# EAGLE design s3-pilot1 (EAGLE 7.1.0)
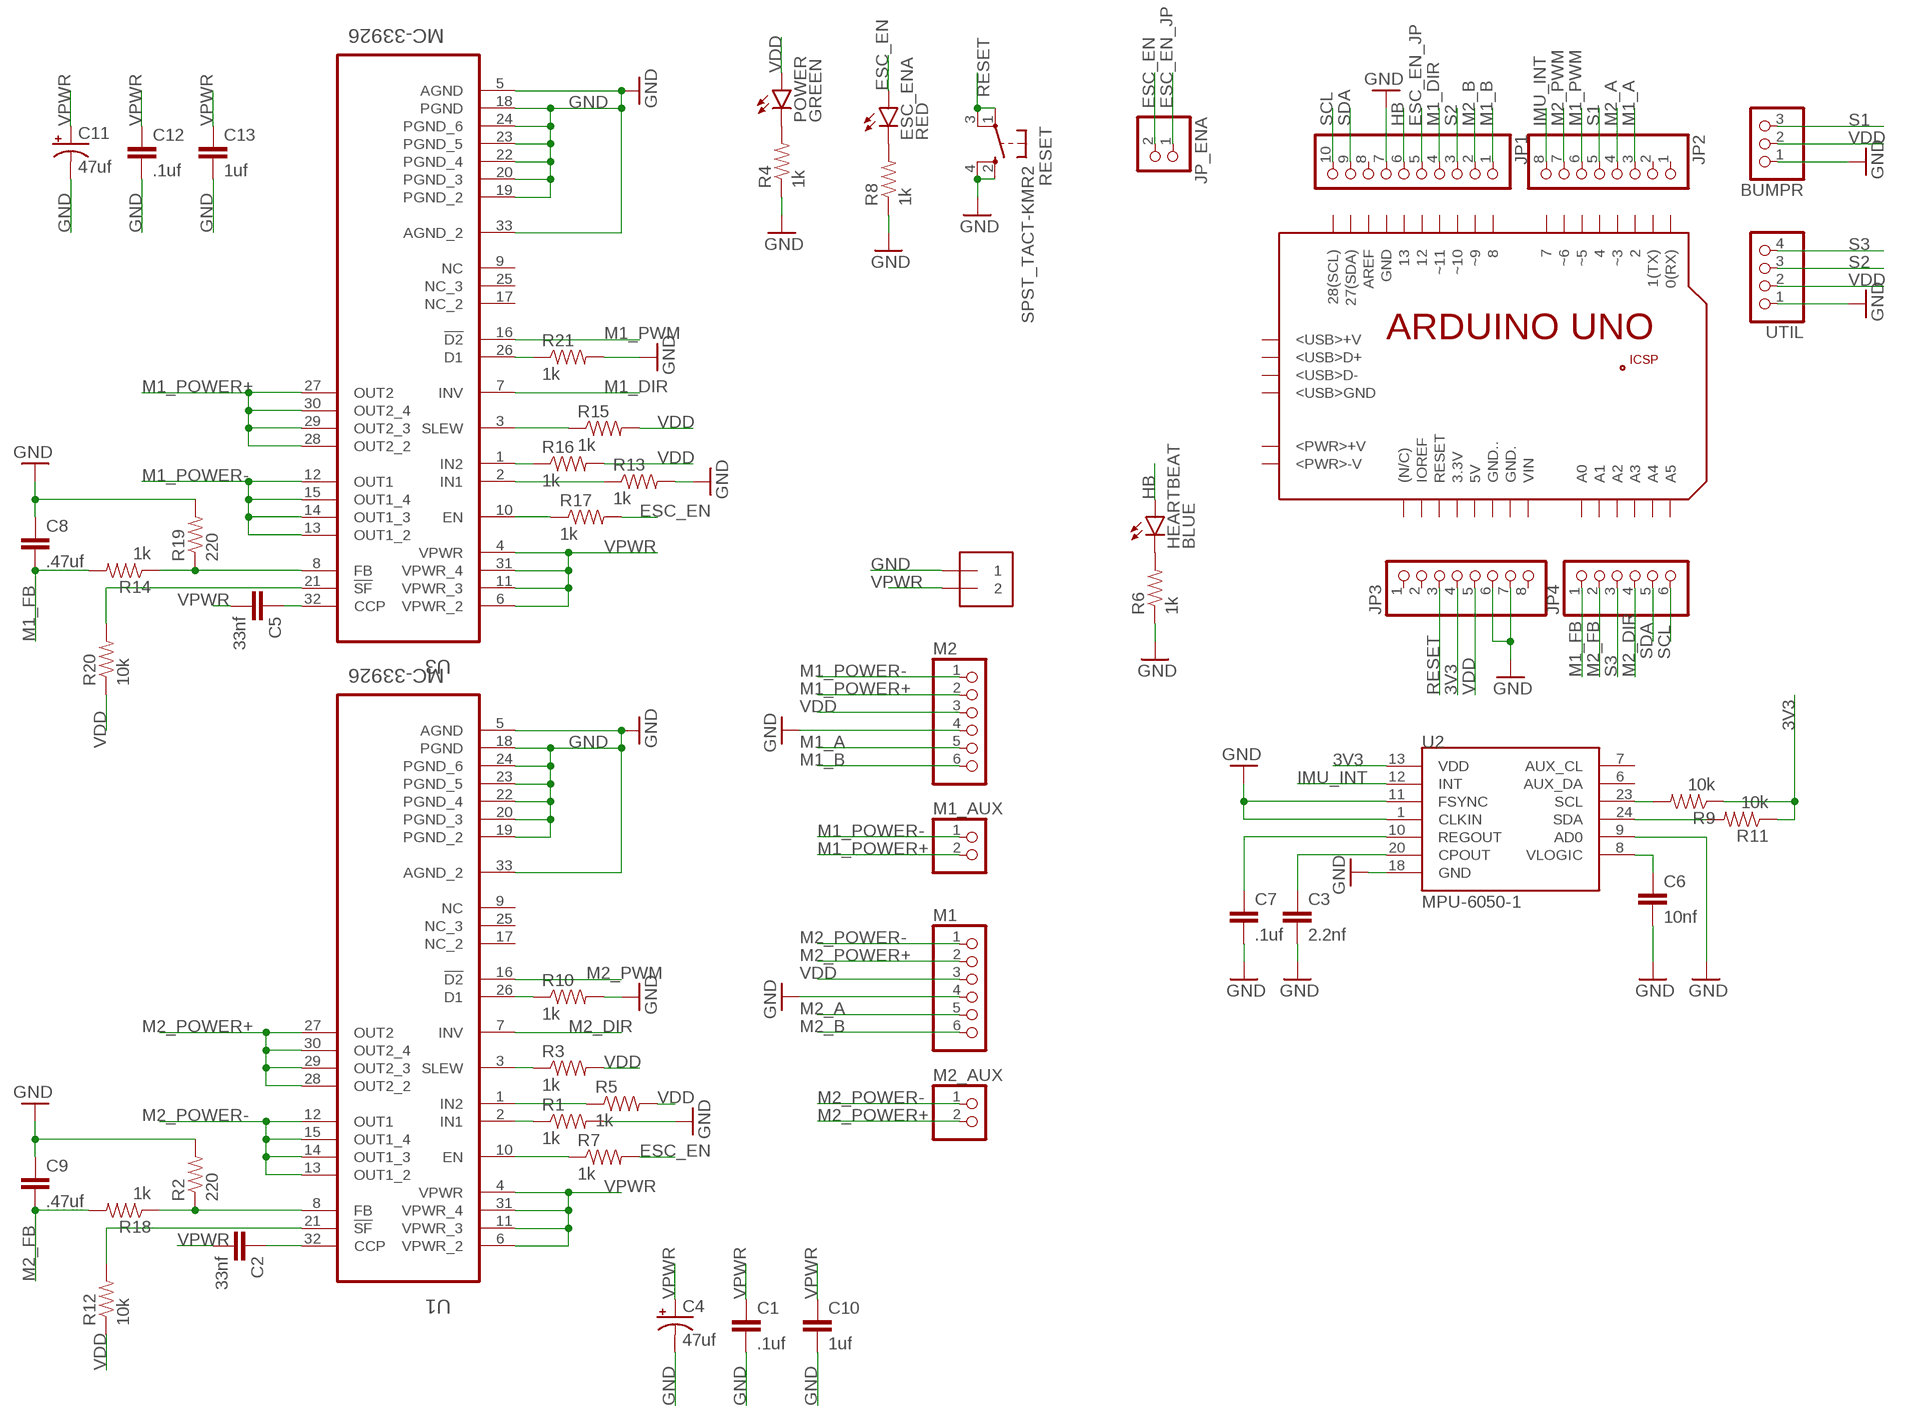
[diagram p0: schematic, sheet 1]

## Parts
BUMPR  PINHD-1X3/90  [1X03/90]
C1  .1uf  CAP0805  [0805]
C2  33nf  CAP0805  [0805]
C3  2.2nf  CAP0805  [0805]
C4  47uf  47UF-50V-20%(ELECT)  [PANASONIC_D]
C5  33nf  CAP0805  [0805]
C6  10nf  CAP0805  [0805]
C7  .1uf  CAP0805  [0805]
C8  .47uf  CAP0805  [0805]
C9  .47uf  CAP0805  [0805]
C10  1uf  CAP0805  [0805]
C11  47uf  47UF-50V-20%(ELECT)  [PANASONIC_D]
C12  .1uf  CAP0805  [0805]
C13  1uf  CAP0805  [0805]
ESC_ENA  RED  LED-RED0603  [LED-0603]
HEARTBEAT  BLUE  LED-BLUE0603  [LED-0603]
JP1  PINHD-1X10  [1X10]
JP2  PINHD-1X8  [1X08]
JP3  PINHD-1X8  [1X08]
JP4  PINHD-1X6  [1X06]
JP_ENA  PINHD-1X2  [1X02]
M1  PINHD-1X6/90  [1X06/90]
M1_AUX  PINHD-1X2/90  [1X02/90]
M2  PINHD-1X6/90  [1X06/90]
M2_AUX  PINHD-1X2/90  [1X02/90]
MOTOR_POWER_IN  1X2-3.5MM  [1X2-3.5MM]
PCB1  ARDUINO_UNO_EXT  (no package)
POWER  GREEN  LED-GREEN0603  [LED-0603]
R1  1k  RESISTOR0805-RES  [0805]
R2  220  RESISTOR0805-RES  [0805]
R3  1k  RESISTOR0805-RES  [0805]
R4  1k  RESISTOR0805-RES  [0805]
R5  1k  RESISTOR0805-RES  [0805]
R6  1k  RESISTOR0805-RES  [0805]
R7  1k  RESISTOR0805-RES  [0805]
R8  1k  RESISTOR0805-RES  [0805]
R9  10k  RESISTOR0805-RES  [0805]
R10  1k  RESISTOR0805-RES  [0805]
R11  10k  RESISTOR0805-RES  [0805]
R12  10k  RESISTOR0805-RES  [0805]
R13  1k  RESISTOR0805-RES  [0805]
R14  1k  RESISTOR0805-RES  [0805]
R15  1k  RESISTOR0805-RES  [0805]
R16  1k  RESISTOR0805-RES  [0805]
R17  1k  RESISTOR0805-RES  [0805]
R18  1k  RESISTOR0805-RES  [0805]
R19  220  RESISTOR0805-RES  [0805]
R20  10k  RESISTOR0805-RES  [0805]
R21  1k  RESISTOR0805-RES  [0805]
RESET  SPST_TACT-KMR2  [KMR2]
U1  MC-33926  FREESCALE-MC33926PNB  [QFN80P800X800X220-33N]
U2  MPU-6050-1  [QFN-24-4MM2]
U3  MC-33926  FREESCALE-MC33926PNB  [QFN80P800X800X220-33N]
UTIL  PINHD-1X4/90  [1X04/90]

## Nets
3V3 [Supply]: JP3.4 R9.1 R11.1 U2.13(VDD)
ESC_EN: ESC_ENA.A JP_ENA.2 R7.2 R17.2
ESC_EN_JP: JP1.5 JP_ENA.1
GND [Supply]: BUMPR.1 C1.2 C3.2 C4.- C6.2 C7.2 C8.1 C9.1 C10.2 C11.- C12.2 C13.2 JP1.7 JP3.6 JP3.7 M1.4 M2.4 MOTOR_POWER_IN.1 R1.2 R2.2 R4.1 R6.1 R8.1 R10.2 R13.2 R19.2 R21.2 RESET.2(S) RESET.4(S1) U1.5(AGND) U1.18(PGND) U1.19(PGND_2) U1.20(PGND_3) U1.22(PGND_4) U1.23(PGND_5) U1.24(PGND_6) U1.33(AGND_2) U2.1(CLKIN) U2.9(AD0) U2.11(FSYNC) U2.18(GND) U3.5(AGND) U3.18(PGND) U3.19(PGND_2) U3.20(PGND_3) U3.22(PGND_4) U3.23(PGND_5) U3.24(PGND_6) U3.33(AGND_2) UTIL.1
HB: HEARTBEAT.A JP1.6
IMU_INT: JP2.8 U2.12(INT)
M1_A: JP2.3 M2.5
M1_B: JP1.1 M2.6
M1_DIR: JP1.4 U3.7(INV)
M1_FB: C8.2 JP4.1 R14.2
M1_POWER+ [MotorSupply]: M1_AUX.2 M2.2 U3.27(OUT2) U3.28(OUT2_2) U3.29(OUT2_3) U3.30(OUT2_4)
M1_POWER- [MotorSupply]: M1_AUX.1 M2.1 U3.12(OUT1) U3.13(OUT1_2) U3.14(OUT1_3) U3.15(OUT1_4)
M1_PWM: JP2.6 U3.16(!D2)
M2_A: JP2.4 M1.5
M2_B: JP1.2 M1.6
M2_DIR: JP4.4 U1.7(INV)
M2_FB: C9.2 JP4.2 R18.2
M2_POWER+ [MotorSupply]: M1.2 M2_AUX.2 U1.27(OUT2) U1.28(OUT2_2) U1.29(OUT2_3) U1.30(OUT2_4)
M2_POWER- [MotorSupply]: M1.1 M2_AUX.1 U1.12(OUT1) U1.13(OUT1_2) U1.14(OUT1_3) U1.15(OUT1_4)
M2_PWM: JP2.7 U1.16(!D2)
N$1: R17.1 U3.10(EN)
N$2: R10.1 U1.26(D1)
N$3: R3.1 U1.3(SLEW)
N$4: R15.1 U3.3(SLEW)
N$5: C5.1 U3.32(CCP)
N$6: C2.1 U1.32(CCP)
N$7: R7.1 U1.10(EN)
N$8: R5.1 U1.1(IN2)
N$9: R1.1 U1.2(IN1)
N$10: R16.1 U3.1(IN2)
N$11: R21.1 U3.26(D1)
N$12: R13.1 U3.2(IN1)
N$15: R12.2 U1.21(!SF)
N$16: R20.2 U3.21(!SF)
N$17: C3.1 U2.20(CPOUT)
N$18: C7.1 U2.10(REGOUT)
N$19: C6.1 U2.8(VLOGIC)
N$20: R2.1 R18.1 U1.8(FB)
N$21: POWER.C R4.2
N$22: R14.1 R19.1 U3.8(FB)
N$23: ESC_ENA.C R8.2
N$24: HEARTBEAT.C R6.2
RESET: JP3.3 RESET.1(P) RESET.3(P1)
S1: BUMPR.3 JP2.5
S2: JP1.3 UTIL.3
S3: JP4.3 UTIL.4
SCL: JP1.10 JP4.6 R9.2 U2.23(SCL)
SDA: JP1.9 JP4.5 R11.2 U2.24(SDA)
VDD [Supply]: BUMPR.2 JP3.5 M1.3 M2.3 POWER.A R3.2 R5.2 R12.1 R15.2 R16.2 R20.1 UTIL.2
VPWR [MotorSupply]: C1.1 C2.2 C4.+ C5.2 C10.1 C11.+ C12.1 C13.1 MOTOR_POWER_IN.2 U1.4(VPWR) U1.6(VPWR_2) U1.11(VPWR_3) U1.31(VPWR_4) U3.4(VPWR) U3.6(VPWR_2) U3.11(VPWR_3) U3.31(VPWR_4)
Unconnected: JP1.8 JP2.1 JP2.2 JP3.1 JP3.2 JP3.8 PCB1.0(RX) PCB1.1(TX) PCB1.2 PCB1.3.3V PCB1.4 PCB1.5V PCB1.7 PCB1.8 PCB1.12 PCB1.13 PCB1.27(SDA) PCB1.28(SCL) PCB1.(N/C) PCB1.+5V PCB1.<PWR>+V PCB1.<PWR>-V PCB1.<USB>+V PCB1.<USB>D+ PCB1.<USB>D- PCB1.<USB>GND PCB1.A0 PCB1.A1 PCB1.A2 PCB1.A3 PCB1.A4 PCB1.A5 PCB1.AREF PCB1.GND PCB1.GND. PCB1.GND.. PCB1.GND_ PCB1.IOREF PCB1.MISO PCB1.MOSI PCB1.RESET PCB1.RESET. PCB1.SCK PCB1.VIN PCB1.~3 PCB1.~5 PCB1.~6 PCB1.~9 PCB1.~10 PCB1.~11 U1.9(NC) U1.17(NC_2) U1.25(NC_3) U2.6(AUX_DA) U2.7(AUX_CL) U3.9(NC) U3.17(NC_2) U3.25(NC_3)

## Library data of the parts
BUMPR = pinhead:PINHD-1X3: PIN HEADER
C1 C2 C5 C8-C10 C12 C13 = Triple_Axis_Accelerometer-Gyro_Breakout_-_MPU-6050_v12:CAP: Capacitor Standard 0603 ceramic capacitor, and 0.1" leaded capacitor.
C3 C6 C7 = SparkFun-Passives:CAP: Capacitor Standard 0603 ceramic capacitor, and 0.1" leaded capacitor.
C4 C11 = SparkFun-Capacitors:47UF-50V-20%(ELECT): CAP-10547; PROD_ID: CAP-10547
ESC_ENA = SparkFun-LED:LED-RED: Assorted Red LEDs LilyPad 1206- DIO-09912 1206- DIO-00809 0603- DIO-00819; PROD_ID: DIO-00819
HEARTBEAT = SparkFun-LED:LED-BLUE: Blue LEDs for production use Various blue LEDs stocked by SparkFun production 0603 - DIO-08575 Rebel - DIO-09553 1206 - DIO-09911; PROD_ID: DIO-08575
JP1 = pinhead:PINHD-1X10: PIN HEADER
JP2 JP3 = pinhead:PINHD-1X8: PIN HEADER
JP4 M1 M2 = pinhead:PINHD-1X6: PIN HEADER
JP_ENA M1_AUX M2_AUX = pinhead:PINHD-1X2: PIN HEADER
MOTOR_POWER_IN = adafruit:1X2: 3.5mm Terminal block http://www.ladyada.net/library/pcb/eaglelibrary.html
PCB1 = E14_Arduino_published:ARDUINO_UNO_EXT: Device for representing an Arduino Uno board in an EAGLE design without the PCB footprint. Created by Dave Young for Element14. More EAGLE documentation at: http://www.element14.com/community/community/knode/cadsoft_eagle
POWER = SparkFun-LED:LED-GREEN: Various green LEDs Green LEDs used in SFE Production 0603- DIO-00821 LARGE- DIO-00862 LILYPAD- DIO-09910; PROD_ID: DIO-00821
R1-R21 = Triple_Axis_Accelerometer-Gyro_Breakout_-_MPU-6050_v12:RESISTOR: Resistor Basic schematic elements and footprints for 0603, 1206, and PTH resistors.
RESET = adafruit:SPST_TACT: SMT 6mm switch, EVQQ2 series http://www.ladyada.net/library/eagle
U1 U3 = Freescale-MC33926PNB:FREESCALE-MC33926PNB: AUTOMOTIVE THROTTLE H-BRIDGE ACTUATOR/ MOTOR EXCITER,QFN-32; MPN: MC33926PNB; OC_FARNELL: 2102575; OC_NEWARK: 40P5023; PACKAGE: QFN-32; SUPPLIER: Freescale
U2 = Triple_Axis_Accelerometer-Gyro_Breakout_-_MPU-6050_v12:MPU-6050
UTIL = pinhead:PINHD-1X4: PIN HEADER

## Net classes
0 Default: width 0.254 mm
1 Supply: width 0.508 mm
2 MotorSupply: width 1.016 mm

## Board
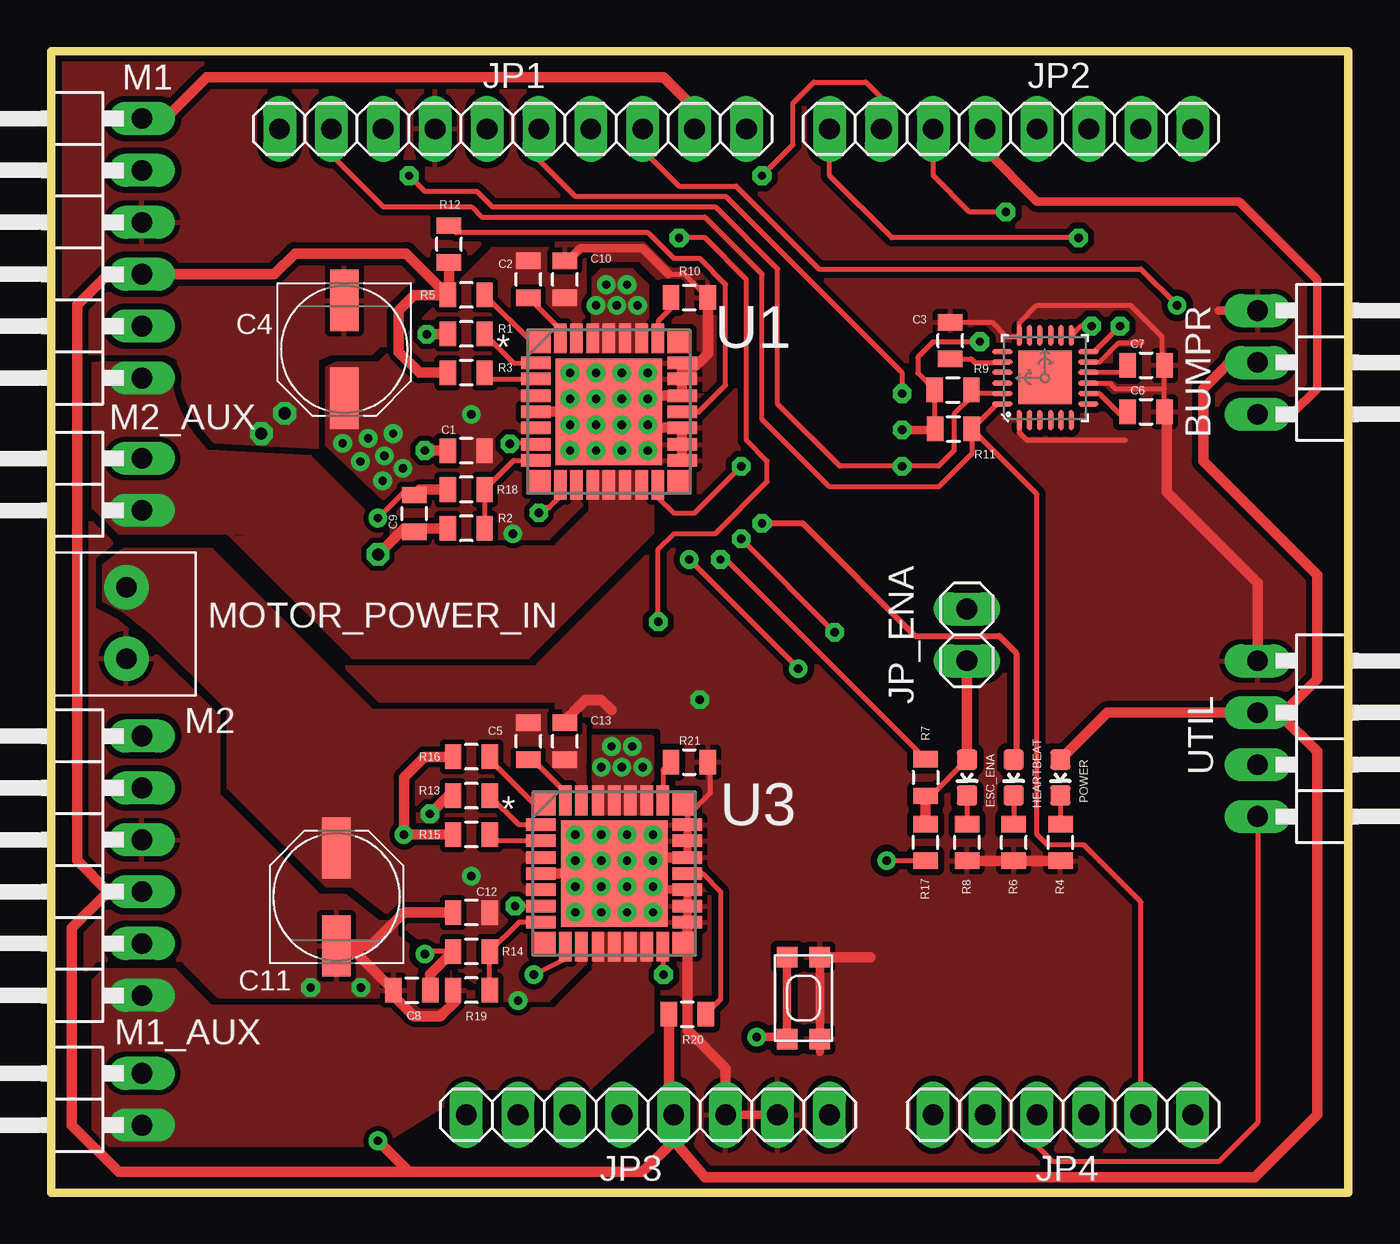
[diagram p1: board, top side]
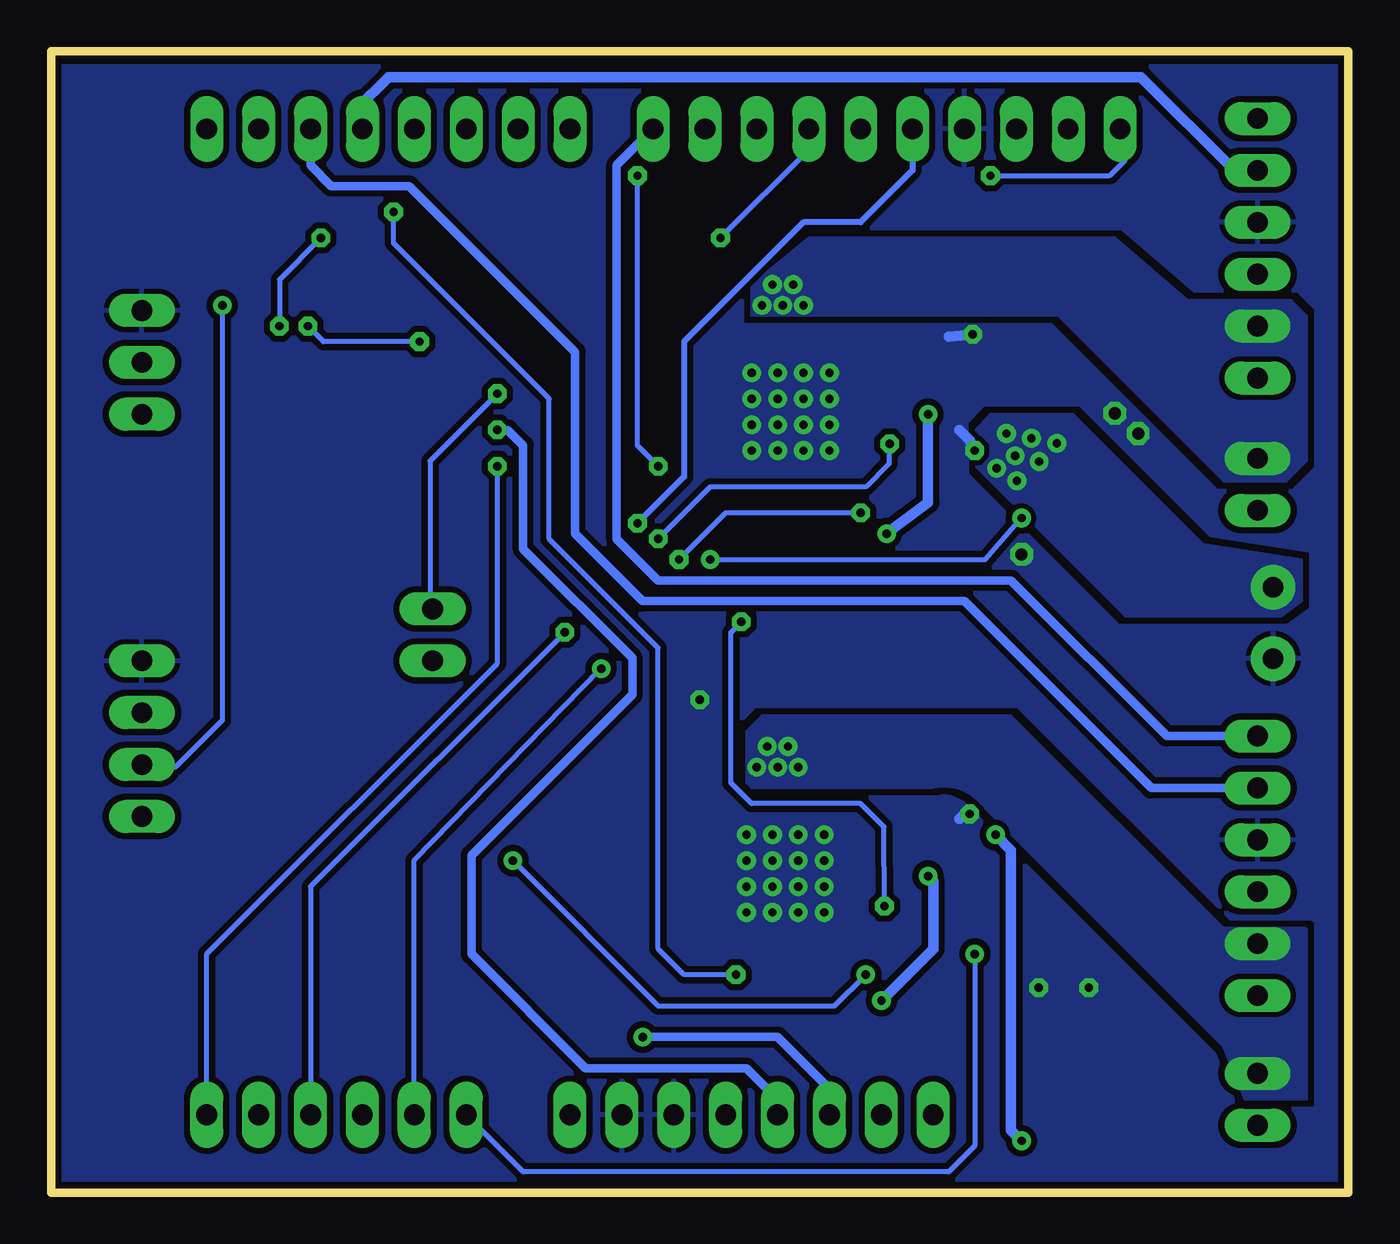
[diagram p2: board, bottom side, seen from below]

Size 63.5 x 55.88 mm. Coordinates in mm from the lower left corner, seen from the top.
Outline: 0,0 63.5,0 63.5,55.88 0,55.88 0,0
Copper layers (1*16): Top 0.035mm / dielectric 1.5mm / Bottom 0.035mm
Design rules "SparkFun *": minimum track width 8mil, minimum drill 16mil, track to track 8mil, track to pad 8mil, pad to pad 8mil, via to via 8mil, smd to smd 8mil, copper to edge 10mil, drill to drill 8mil, minimum pad ring 12mil, minimum via ring 10mil, stop-mask expansion 4mil, vias tented up to drill 25mil, thermal gap 10mil

### Footprints (pad centres in the part's own frame; a part is rotated, then mirrored left to right if it is on the bottom)
1X03/90 = drill 1.016 long: 1 -2.54,-3.81; 2 0,-3.81; 3 2.54,-3.81
0805 = smd 0.8 x 1.2: 1 -0.9,0; 2 0.9,0
PANASONIC_D = smd 3 x 1.4: + 2.4,0; - -2.4,0
LED-0603 = smd 1 x 1: A 0,-0.877; C 0,0.877
1X10 = drill 1.016 long: 1 -11.43,0; 2 -8.89,0; 3 -6.35,0; 4 -3.81,0; 5 -1.27,0; 6 1.27,0; 7 3.81,0; 8 6.35,0; 9 8.89,0; 10 11.43,0
1X08 = drill 1.016 long: 1 -8.89,0; 2 -6.35,0; 3 -3.81,0; 4 -1.27,0; 5 1.27,0; 6 3.81,0; 7 6.35,0; 8 8.89,0
1X06 = drill 1.016 long: 1 -6.35,0; 2 -3.81,0; 3 -1.27,0; 4 1.27,0; 5 3.81,0; 6 6.35,0
1X02 = drill 1.016 long: 1 -1.27,0; 2 1.27,0
1X06/90 = drill 1.016 long: 1 -6.35,-3.81; 2 -3.81,-3.81; 3 -1.27,-3.81; 4 1.27,-3.81; 5 3.81,-3.81; 6 6.35,-3.81
1X02/90 = drill 1.016 long: 1 -1.27,-3.81; 2 1.27,-3.81
1X2-3.5MM = drill 1 pad 2.184: 1 1.8,0; 2 -1.7,0
KMR2 = smd 1 x 1: 1 2,0.8; 2 2,-0.8; 3 -2,0.8; 4 -2,-0.8
QFN80P800X800X220-33N = smd 1.143 x 1.143: 1 -3.429,3.429; 9 -3.429,-3.429; 17 3.429,-3.429; 25 3.429,3.429 | smd 1.448 x 0.61: 2 -3.581,2.388; 3 -3.581,1.6; 4 -3.581,0.787; 5 -3.581,0; 6 -3.581,-0.787; 7 -3.581,-1.6; 8 -3.581,-2.388; 18 3.581,-2.388; 19 3.581,-1.6; 20 3.581,-0.787; 21 3.581,0; 22 3.581,0.787; 23 3.581,1.6; 24 3.581,2.388 | smd 0.61 x 1.448: 10 -2.388,-3.581; 11 -1.6,-3.581; 12 -0.787,-3.581; 13 0,-3.581; 14 0.787,-3.581; 15 1.6,-3.581; 16 2.388,-3.581; 26 2.388,3.581; 27 1.6,3.581; 28 0.787,3.581; 29 0,3.581; 30 -0.787,3.581; 31 -1.6,3.581; 32 -2.388,3.581 | smd 5.207 x 5.207: 33 0,0
QFN-24-4MM2 = smd 1.016 x 0.254: 1 -2.066,1.257; 2 -2.066,0.75; 3 -2.066,0.247; 4 -2.066,-0.287; 5 -2.066,-0.792; 6 -2.066,-1.297; 13 2.086,-1.297; 14 2.086,-0.792; 15 2.086,-0.287; 16 2.086,0.247; 17 2.086,0.75; 18 2.086,1.257 | smd 0.254 x 1.016: 7 -1.267,-2.122; 8 -0.762,-2.122; 9 -0.258,-2.122; 10 0.278,-2.122; 11 0.78,-2.122; 12 1.287,-2.122; 19 1.287,2.082; 20 0.78,2.082; 21 0.278,2.082; 22 -0.258,2.082; 23 -0.762,2.082; 24 -1.267,2.082 | smd 2.616 x 2.616: P$1 0.02,-0.01
1X04/90 = drill 1.016 long: 1 -3.81,-3.81; 2 -1.27,-3.81; 3 1.27,-3.81; 4 3.81,-3.81

### Placement (x,y rotation side)
BUMPR  62.87,40.64 270 top
C1  20.32,36.32 180 top
C2  23.37,44.7 90 top
C3  44.01,41.71 90 top
C4  14.35,41.27 270 top
C5  23.37,22.1 90 top
C6  53.59,38.23 0 top
C7  53.59,40.51 0 top
C8  17.66,9.91 0 top
C9  17.78,33.25 90 top
C10  25.15,44.7 90 top
C11  13.97,14.48 90 top
C12  20.57,13.72 180 top
C13  25.15,22.1 90 top
ESC_ENA  44.83,20.32 180 top
HEARTBEAT  47.12,20.32 180 top
JP1  22.61,52.07 180 top
JP2  46.99,52.07 180 top
JP3  29.21,3.81 0 top
JP4  49.53,3.81 0 top
JP_ENA  44.83,27.3 270 top
M1  0.63,46.23 90 top
M1_AUX  0.63,4.57 90 top
M2  0.63,16 90 top
M2_AUX  0.63,34.67 90 top
MOTOR_POWER_IN  3.68,27.94 270 top
POWER  49.4,20.32 180 top
R1  20.32,42.04 180 top
R2  20.32,32.51 180 top
R3  20.32,40.13 180 top
R4  49.4,17.14 90 top
R5  20.32,43.94 180 top
R6  47.12,17.14 90 top
R7  42.8,20.32 270 top
R8  44.83,17.14 90 top
R9  44.15,39.29 0 top
R10  31.24,43.81 0 top
R11  44.17,37.39 0 top
R12  19.48,46.43 90 top
R13  20.57,19.43 180 top
R14  20.57,11.81 180 top
R15  20.57,17.53 180 top
R16  20.57,21.34 180 top
R17  42.8,17.14 90 top
R18  20.32,34.42 180 top
R19  20.57,9.91 180 top
R20  31.14,8.74 0 top
R21  31.24,21.08 0 top
RESET  36.83,9.52 90 top
U1  27.3,38.23 0 top
U2  48.64,39.88 90 top
U3  27.56,15.62 0 top
UTIL  62.87,22.23 270 top

### Tracks (layer width: path | path; a pad name or v marks a point on that pad's centre or on a via)
3V3  (via drill 0.41)
  Top 0.254: R11.1 43.27,39.27 R9.1 42.42,40.12 42.42,40.89 43.18,41.66 v45.47,41.66 | v50.93,42.42 50.39,42.42 U2.13
  Top 0.406: v41.66,37.34 43.22,37.34 R11.1
  Bottom 0.254: v45.47,41.66 50.16,41.66 v50.93,42.42
  Bottom 0.406: JP3.4 27.94,4.57 29.46,6.1 37.34,6.1 42.93,11.68 42.93,16.51 35.05,24.38 35.05,26.16 40.39,31.5 40.39,36.58 41.15,37.34 v41.66,37.34
ESC_EN
  Top 0.254: R7.2 43.05,19.42 ESC_ENA.A
  Top 0.508: R17.2 R7.2 | JP_ENA.2 ESC_ENA.A
ESC_EN_JP  (via drill 0.41)
  Top 0.254: JP1.5 23.88,50.55 25.65,48.77 33.02,48.77 41.66,40.13 v41.66,39.12
  Bottom 0.254: v41.66,39.12 44.96,35.81 44.96,28.7 JP_ENA.1
GND  (via drill 0.41, 0.6)
  Top 0.254: C6.2 54.49,39.37 | 54.49,39.37 C7.2 54.36,40.65 54.36,41.91 52.83,43.43 48.26,43.43 47.38,42.56 U2.18 47.33,41.91 46.74,41.91 46.04,42.61 C3.2 | U2.11 51.33,40.66 52.27,41.6 53.4,41.6 | U2.1 47.38,37.2 47.75,36.83 52.59,36.83 | R21.2 32.26,20.97 32.26,19.56 31.14,18.44 U3.24 | C10.2 25.28,45.6 | 30.23,44.96 31,44.96 R10.2 | U2.9 51.82,39.62 52.07,39.37 54.49,39.37
  Top 0.406: U3.33 27.56,15.24 28.7,15.24 28.7,14.83 U3.20 U3.19 U3.18 | U3.24 U3.23 U3.22 | RESET.2 RESET.4 37.63,6.9 | 35.56,4.83 JP3.7 JP3.6 | BUMPR.1 57.17,43.18 | 25.28,45.6 25.91,46.23 28.96,46.23 30.23,44.96
  Top 0.508: U3.5 U3.33 28.35,16.41 U3.22 | R19.2 19.77,9.8 arc-45 19.81,9.71 19.81,9.4 19.09,8.67 arc-45 19,8.64 17.78,8.64 16.8,9.62 arc-45 16.76,9.71 C8.1 15.15,11.52 arc-45 15.11,11.61 C11.- 15.63,12.08 17.27,13.72 C12.2 | U3.18 31.14,7.98 33.02,6.1 JP3.6 | C9.1 17.94,32.51 R2.2 17.27,32.51 v16,31.24 | 27.84,37.49 27.89,37.44 U1.20 U1.19 U1.18 | 27.84,37.49 27.3,38.02 U1.33 | U1.5 U1.33 | U1.33 27.3,38.89 27.43,39.01 U1.22 U1.23 | U1.23 U1.24 | R10.2 32.14,41.08 U1.23 | UTIL.1 59.05,29.84 54.61,34.29 54.61,38.62 C6.2 | R8.1 R4.1 R6.1 | RESET.2 40.11,11.52 | C1.2 v18.29,36.32 | R1.2 18.67,42.04 v18.39,42.01 | C13.2 25.15,23.11 26.16,24.13 26.92,24.13 27.43,23.62 | R13.2 19.43,19.43 v18.54,18.54 | v27.94,37.59 27.84,37.49
  Bottom 0.508: v18.29,36.32 18.54,36.83 19.05,37.34 | v16,31.24 15.75,30.99 | v18.39,42.01 19.56,41.91 | v18.54,18.54 18.8,18.54 19.05,18.29
  other vias: 25.4,36.32 25.4,40.13 26.67,37.59 26.67,38.86 26.67,40.13 26.67,36.32 27.94,38.86 27.94,36.32 27.94,40.13 25.4,38.86 25.4,37.59 29.21,40.13 29.21,38.86 29.21,37.59 29.21,36.32 25.65,17.53 25.65,16.26 26.92,17.53 26.92,16.26 25.65,14.99 25.65,13.72 26.92,13.72 29.46,17.53 28.19,16.26 28.19,17.53 29.46,16.26 29.46,14.99 29.46,13.72 28.19,13.72 28.19,14.99 26.92,14.99 11.43,38.15 10.29,37.16 12.7,10.03 15.16,10.03 31.75,24.13
  pour Top (isolate 0.305, rank 4): 0.51,55.37 62.99,55.37 62.99,0.25 0.51,0.25
  pour Bottom (isolate 0.305, rank 4): 0.51,55.12 62.99,55.12 62.99,0.51 0.51,0.51
HB  (via drill 0.41)
  Top 0.305: v34.8,32.77 36.78,32.77 42.29,27.25 46.41,27.25 47.24,26.42 47.24,21.32 HEARTBEAT.A
  Bottom 0.305: JP1.6 21.34,50.04 23.88,47.5 26.67,47.5 32.51,41.66 32.51,35.05 v34.8,32.77
IMU_INT  (via drill 0.41)
  Top 0.254: U2.12 51.07,41.16 v52.32,42.42 | v50.29,46.74 41.15,46.74 38.1,49.78 JP2.8
  Bottom 0.254: v52.32,42.42 52.32,44.7 v50.29,46.74
M1_A
  Bottom 0.406: M2.5 9.65,19.81 18.8,28.96 34.54,28.96 37.85,32.26 37.85,41.15 45.97,49.28 49.78,49.28 50.8,50.29 JP2.3
M1_B
  Bottom 0.406: M2.6 8.89,22.35 16.51,29.97 33.78,29.97 35.81,32 35.81,50.29 JP1.1
M1_DIR  (via drill 0.41)
  Top 0.254: U3.7 v22.71,14.02 | v29.72,27.94 29.72,31.5 30.48,32.26 32.51,32.26 35.05,34.8 35.05,35.81 34.04,36.83 34.04,44.7 32,46.74 v30.73,46.74
  Bottom 0.254: v22.71,14.02 22.73,17.91 23.88,19.05 29.21,19.05 30.23,20.07 30.23,27.43 v29.72,27.94 | v30.73,46.74 26.42,51.05 JP1.4
M1_FB  (via drill 0.41)
  Top 0.254: R14.2 18.41,11.81 v18.29,11.68
  Top 0.508: C8.2 18.56,10.64 arc-45 18.6,10.73 R14.2
  Bottom 0.254: v18.29,11.68 18.29,2.29 19.56,1.02 40.39,1.02 JP4.1
M1_POWER+  (via drill 0.41)
  other vias: 26.92,20.83 27.94,20.83 28.96,20.83 27.43,21.84 28.45,21.84
  pour Top (isolate 0.254, rank 2, no thermals): 26.42,18.54 26.42,22.1 26.42,22.23 arc-90 26.54,22.35 29.34,22.35 arc-90 29.46,22.23 29.46,18.54
  pour Bottom (isolate 0.254, no thermals): 2.03,4.57 2.03,12.83 arc-90 2.16,12.95 6.1,12.95 16.51,23.37 28.65,23.37 arc-45 28.74,23.33 29.46,22.61 29.46,20.12 arc-45 29.43,20.03 29.21,19.81 20.37,19.81 arc45 18.5,19.52 6.1,7.11 5.08,4.57
M1_POWER-
  pour Top (isolate 0.254, rank 2, no thermals): 2.03,10.41 2.03,3.1 arc45 2.07,3.01 2.79,2.29 15.19,2.29 arc45 16.55,2.58 20.57,5.08 26.36,5.08 arc45 26.45,5.12 29.46,7.87 29.46,12.7 26.42,12.7 26.42,11.23 arc-45 26.38,11.14 24.38,9.14 7.93,9.14 arc-45 7.84,9.18 6.1,10.92 2.59,10.92 arc45 2.5,10.88
M1_PWM  (via drill 0.41)
  Top 0.254: U3.16 29.95,10.9 v29.97,10.67 | v46.74,48.01 44.96,48.01 43.18,49.78 JP2.6
  Bottom 0.254: v29.97,10.67 32.51,10.67 33.78,11.94 33.78,26.67 39.12,32 39.12,38.86 46.74,46.48 v46.74,48.01
M2_A
  Bottom 0.508: M1.5 5.59,50.04 10.16,54.61 46.99,54.61 48.51,53.09 48.51,52.32 JP2.4
M2_B
  Top 0.508: M1.6 5.59,52.58 7.62,54.61 29.97,54.61 31.5,53.09 JP1.2
M2_DIR  (via drill 0.41)
  Top 0.254: U1.7 22.63,36.7 v22.45,36.65 | v33.78,32 v38.35,27.43
  Bottom 0.254: v22.45,36.65 22.48,35.69 23.62,34.54 31.24,34.54 v33.78,32 | v38.35,27.43 50.8,14.99 JP4.4
M2_FB  (via drill 0.41)
  Top 0.254: v36.58,25.65 v31.24,30.99 | v16,33.02 17.27,34.29 17.64,34.29 C9.2
  Top 0.508: C9.2 18.05,34.42 R18.2
  Bottom 0.254: JP4.2 45.72,16.26 v36.58,25.65 | v31.24,30.99 17.78,30.99 v16,33.02
M2_POWER+  (via drill 0.41)
  other vias: 26.67,43.43 27.69,43.43 28.7,43.43 27.18,44.45 28.19,44.45
  pour Top (isolate 0.254, rank 2, no thermals): 26.16,41.15 26.16,44.4 arc-45 26.2,44.49 26.92,45.21 28.4,45.21 arc-45 28.49,45.17 29.21,44.45 29.21,41.15
  pour Bottom (isolate 0.254, no thermals): 29.21,42.93 14.22,42.93 6.1,34.8 3.05,34.8 2.03,35.81 2.03,42.93 2.79,43.69 7.87,43.69 11.43,46.74 26.42,46.74 29.21,44.45
M2_POWER-
  pour Top (isolate 0.254, rank 2, no thermals): 2.03,40.64 2.03,33.58 arc45 2.07,33.49 3.3,32.26 9.85,32.26 arc-45 8.67,32.22 14.73,26.16 23.32,26.16 arc45 23.41,26.2 29.46,32.26 29.46,35.31 25.65,35.31 25.65,33.78 23.88,32 16.82,32 arc-45 16.73,32.04 12.7,36.07 7.67,36.32 arc-45 5.8,40.42 5.33,40.64 2.34,40.64 arc45 2.25,40.6
M2_PWM  (via drill 0.41)
  Top 0.254: U1.16 29.69,34.06 30.48,33.27 31.5,33.27 v33.78,35.56 | v34.8,49.78 36.32,51.31 36.32,53.34 37.34,54.36 39.88,54.36 40.64,53.59 JP2.7
  Bottom 0.254: v33.78,35.56 34.8,36.58 v34.8,49.78
N$1  (via drill 0.41)
  Top 0.254: U3.10 25.17,11.45 v23.62,10.67 | v40.89,16.26 42.79,16.26 R17.1
  Bottom 0.254: v40.89,16.26 33.78,9.14 25.15,9.14 v23.62,10.67
N$2
  Top 0.254: R10.1 30.34,43.3 29.72,42.67 29.72,41.83 U1.26
N$3
  Top 0.254: R3.1 21.52,39.83 U1.3
N$4
  Top 0.254: U3.3 21.78,17.22 R15.1
N$5
  Top 0.254: C5.1 23.53,21.2 arc-45 23.62,21.16 24.97,19.81 25.09,19.81 arc-45 25.15,19.79 25.15,19.26 arc45 U3.32
N$6
  Top 0.254: C2.1 24.88,42.29 arc-45 24.92,42.2 U1.32
N$7  (via drill 0.41)
  Top 0.254: U1.10 24.92,34.06 24.38,33.53 24.13,33.53 v23.88,33.27 | v32.77,30.99 33.03,30.99 R7.1
  Bottom 0.254: v23.88,33.27 30.48,33.27 v32.77,30.99
N$8
  Top 0.254: R5.1 23.51,41.66 U1.1
N$9
  Top 0.254: R1.1 22.64,40.62 U1.2
N$10
  Top 0.254: R16.1 21.47,21.25 arc45 21.51,21.16 23.62,19.05 U3.1
N$11
  Top 0.254: R21.1 29.95,20.69 U3.26
N$12
  Top 0.254: U3.2 22.9,18.01 R13.1
N$15
  Top 0.254: U1.21 30.91,38.2 31.7,38.2 33.02,39.52 33.02,44.45 31.75,45.72 30.48,45.72 29.21,46.99 19.82,46.99 R12.2
N$16
  Top 0.254: U3.21 31.88,15.62 32.77,14.73 32.77,9.46 R20.2
N$17
  Top 0.254: C3.1 45.04,40.81 45.21,40.64 46.54,40.64 U2.20
N$18
  Top 0.254: U2.10 52.34,40.16 C7.1
N$19
  Top 0.254: U2.8 51.31,39.12 52.32,38.1 52.57,38.1 C6.1
N$20
  Top 0.254: U1.8 22.64,35.84 R18.1 R2.1
N$21
  Top 0.254: POWER.C R4.2
N$22
  Top 0.254: U3.8 22.9,13.23 R14.1 R19.1
N$23
  Top 0.254: ESC_ENA.C R8.2
N$24
  Top 0.254: HEARTBEAT.C R6.2
RESET  (via drill 0.41)
  Top 0.406: RESET.1 RESET.3 36.03,7.62 v34.54,7.62
  Bottom 0.406: v34.54,7.62 27.94,7.62 25.4,5.08 JP3.3
S1
  Top 0.406: JP2.5 45.72,51.05 48.26,48.51 58.17,48.51 61.98,44.7 61.98,39.37 60.71,38.1 BUMPR.3
S2  (via drill 0.41)
  Top 0.254: JP1.3 28.96,51.05 30.73,49.28 33.53,49.28 37.59,45.21 53.34,45.21 v55.12,43.43
  Bottom 0.254: v55.12,43.43 55.12,23.11 57.4,20.83 58.93,20.83 UTIL.3
S3
  Top 0.254: UTIL.4 59.05,3.43 57.15,1.52 49.02,1.52 48.26,2.29 JP4.3
SCL  (via drill 0.41)
  Top 0.254: U2.23 45.22,39.12 R9.2 45.05,38.95 44.2,38.1 44.2,36.32 43.43,35.56 v41.66,35.56 38.61,35.56 35.56,38.61 35.56,45.21 32.51,48.26 21.59,48.26 20.83,49.02 18.29,49.02 v17.53,49.78
  Bottom 0.254: v17.53,49.78 11.68,49.78 10.92,50.55 10.92,51.82 JP1.10 | JP4.6 55.88,11.68 41.66,25.91 v41.66,35.56
SDA
  Top 0.254: U2.24 46.29,38.61 R11.2 | R11.2 45.07,36.18 43.43,34.54 38.1,34.54 34.8,37.85 34.8,44.96 32,47.75 21.08,47.75 20.57,48.26 16.26,48.26 13.72,50.8 JP1.9 | JP4.5 53.34,14.22 50.55,17.02 48.77,17.02 48.26,17.53 48.26,34.19 R11.2
VDD  (via drill 0.41)
  Top 0.508: R20.1 30.24,4.05 JP3.5 | R5.2 17.39,45.97 11.94,45.97 10.92,44.96 M1.3 2.79,44.96 1.27,43.43 1.27,16.26 2.79,14.73 | M2.3 2.79,14.73 | 2.79,14.73 1.02,12.95 1.02,3.3 3.3,1.02 17.53,1.02 | 30.48,2.54 28.96,1.02 17.53,1.02 | 30.48,2.54 JP3.5 | BUMPR.2 57.66,40.64 56.39,39.37 56.39,35.81 61.98,30.23 61.98,25.15 60.2,23.37 | R12.1 19.48,44 R5.2 | POWER.A 51.7,23.5 UTIL.2 59.18,23.37 60.2,23.37 | 60.2,23.37 61.98,21.59 61.98,3.81 58.93,0.76 32,0.76 30.48,2.54 | JP3.5 30.48,4.06 | R3.2 18.03,40.13 17.02,41.15 17.02,43.18 17.78,43.94 R5.2 | R16.2 18.29,21.34 17.27,20.32 v17.27,17.53 R15.2 | v16,2.54 17.53,1.02
  Bottom 0.508: v17.27,17.53 16.51,16.76 16.51,3.05 v16,2.54
VPWR  (via drill 0.41)
  Bottom 0.508: v22.61,32.26 20.57,33.78 v20.57,38.1 | v22.86,9.4 20.32,11.94 20.32,15.24 v20.57,15.49
  other vias: 15.52,36.93 16.74,37.16 15.14,35.79 16.31,36.07 17.22,35.46 16.23,34.85 14.27,36.68
  pour Top (isolate 0.254, no thermals): 3.56,31.5 7.87,31.5 15.75,23.62 25.4,23.62 26.16,22.86 26.16,11.18 24.38,9.4 21.84,9.4 14.73,14.99 13.46,14.99 8.64,19.81 8.64,23.62 4.83,27.43 3.56,28.45 2.54,28.96 2.54,30.73
  pour Top (isolate 0.254, no thermals): 13.46,40.39 13.46,36.58 18.29,32 24.38,32 26.16,33.78 26.16,45.72 25.65,46.23 21.59,46.23 16,40.64 13.97,40.64
  pour Bottom (isolate 0.254, no thermals): 2.29,30.99 2.29,28.96 3.3,28.19 10.92,28.19 18.29,35.56 18.29,37.34 17.53,38.1 13.46,38.1 7.11,31.75